# Altium schematic sheet LT3042_5V.SchDoc
size A4; SheetNumber: 7; SheetTotal: 27
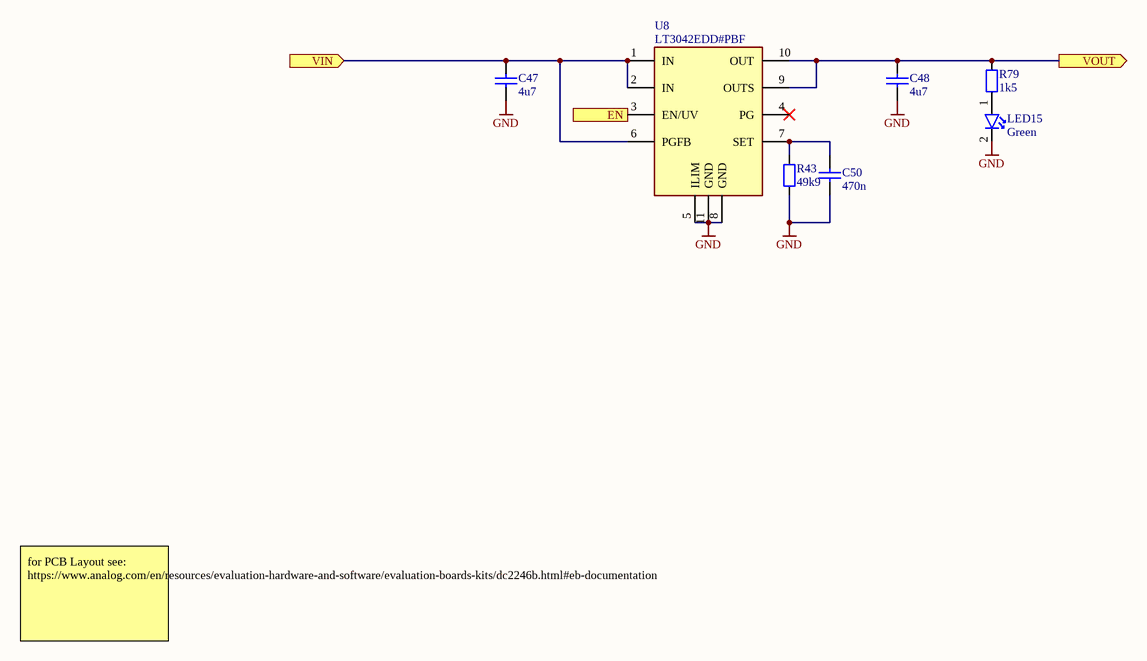
[diagram p0: LT3042_5V.SchDoc]

## Parts
C47  4u7  [C_1206_3216Metric_IPC_N]
C48  4u7  [C_1206_3216Metric_IPC_N]
C50  470n  [C_0402_1005Metric_IPC_N]
LED15  Green  [LED_0603_1806Metric_IPC_N]
R43  49k9  [R_0402_1005Metric_IPC_N]
R79  1k5  [R_0402_1005Metric_IPC_N]
U8  LT3042EDD#PBF  [DFN10_3x3]

## Ports
EN (in, see Power_Supply[5B]), VIN (in, see Power_Supply[5B]), VOUT (out, see Power_Supply[6B])

## Nets
GND: C47.1 C48.1 C50.1 LED15.2 R43.1 U8.5(ILIM) U8.8(GND) U8.11(GND)
EN: U8.3(EN/UV) ; port EN
VIN: C47.2 U8.1(IN) U8.2(IN) U8.6(PGFB) ; port VIN
VOUT: C48.2 R79.1 U8.9(OUTS) U8.10(OUT) ; port VOUT
NetC50_2: C50.2 R43.2 U8.7(SET)
NetLED15_1: LED15.1 R79.2

Not connected (* = marked no-connect by the designer): U8 4(PG)*

## Notes on the sheet
- for PCB Layout see:
  https://www.analog.com/en/resources/evaluation-hardware-and-software/evaluation-boards-kits/dc2246b.html#eb-documentation

## Library data of the parts
C47 C48 = C000005: Generic MLCC with 1206 Footprint; Specific Component: False; Temp Coefficient: X7R; Voltage Rated: 15V; ID: C000005; Capacitance: 4u7; Tolerance: *; min Temperature: *; max Temperature: *; Case: 1206
C50 = C000002: Generic MLCC with 0402 Footprint; Specific Component: False; Temp Coefficient: X7R; ID: C000002; Capacitance: 470n; Tolerance: *; Voltage Rated: *; min Temperature: *; max Temperature: *; Case: 0402
LED15 = LED000007: MLCC, Low Current, Green, 2.2V, 20mA, 0603; Manufacturer: Broadcom / Avago; Manufacturer Part Number: HSMG-C190; Specific Component: True; ID: LED000007; Type: Low Current; Colour: Green; Forward Voltage: 2.2V; Current: 20mA; Case: 0603; ComponentLink1Description: Datasheet; ComponentLink1URL: https://www.mouser.de/datasheet/3/57/1/AV02_0551EN_DS_HSMx_Cxxx_25Mar2022.pdf; Supplier 1: Mouser; Supplier Part Number 1: 630-HSMG-C190; Supplier 2: Digikey; Supplier Part Number 2: 516-1425-1-ND
R43 R79 = R000002: Generic Chip Resistor with 0402 Footprint; Specific Component: False; ID: R000002; Tolerance: *; Power Rating: *; Composition: *; min Temperature: *; max Temperature: *; Temp Coefficient: *; Case: 0402
  R43: Resistance: 49k9
  R79: Resistance: 1k5
U8 = PMIC000029: Manufacturer: Analog Devices; ID: PMIC000029; Type: LDO; Manufacturer Part Number: LT3042EDD#PBF; Part Value: LT3042EDD#PBF; Case: 10-DFN (3x3); ComponentLink1Description: Datasheet; ComponentLink1URL: https://www.analog.com/media/en/technical-documentation/data-sheets/lt3042.pdf; Supplier 1: Digikey; Supplier Part Number 1: 505-LT3042EDD#PBF-ND; Supplier 2: Mouser; Supplier Part Number 2: 584-LT3042EDD#PBF